# Altium schematic sheet Power.SchDoc
size A
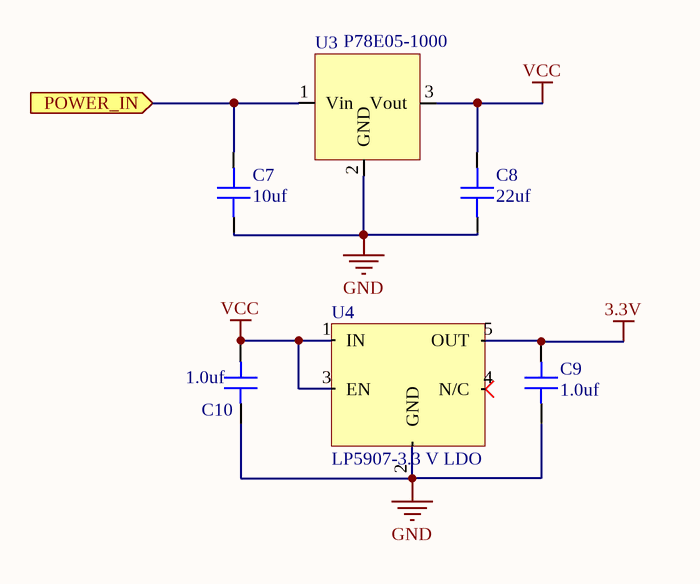
[diagram p0: Power.SchDoc]

## Parts
C7  value 10uf  [CAP 1206/3216 - 1.8MM]  (hidden comment: Capacitor MLCC 1.1pf 50V CAP 1206/3216)
C8  value 22uf  [CAP 0805/2012]  (hidden comment: Capacitor MLCC 22uf 16V CAP 0805/2012)
C9  value 1.0uf  [CAP 0603/1608]  (hidden comment: Capacitor MLCC 1.0uf 16V CAP 0603/1608)
C10  value 1.0uf  [CAP 0603/1608]  (hidden comment: Capacitor MLCC 1.0uf 16V CAP 0603/1608)
U3  P78E05-1000  [P78E05]
U4  LP5907-3.3 V LDO  [SOT23-5]

## Ports
POWER_IN (in)

## Nets
3.3V: C9.2 U4.5(OUT)
GND: C7.1 C8.1 C9.1 C10.1 U3.2(GND) U4.2(GND)
VCC: C8.2 C10.2 U3.3(Vout) U4.1(IN) U4.3(EN)
POWER_IN: C7.2 U3.1(Vin) ; port POWER_IN

Not connected (* = marked no-connect by the designer): U4 4(N/C)*

## Library data of the parts
C7 = 1081: Manufacturer_id: 1; idCapacitor: 1081; Name: Cap_10uf_50V_CAP 1206-3216; Dielectric: Ceramic; ESR: Null; Created_By: Nick Mah; Drawer_id: 1; Voltage_Rating: 50V; Package: CAP 2106/3216; ComponentLink1Description: Datasheet
C8 = 357: Manufacturer_id: 1; idCapacitor: 357; Name: Cap_22uf_16V_CAP 0805/2012; Dielectric: Ceramic; Created_By: Nick Mah; Drawer_id: 1; Voltage_Rating: 16V; Package: CAP 0805/2012; Created_Date: 10/20/2018
C9 C10 = 229: Manufacturer_id: 1; idCapacitor: 229; Name: Cap_1.0uf_16V_CAP 0603/1608; Dielectric: Ceramic; Created_By: Nick Mah; Drawer_id: 1; Voltage_Rating: 16V; Package: CAP 0603/1608; Created_Date: 10/20/2018
U3 = 1: Non-Isolated PoL Module DC DC Converter 1 Output 5V    1A 8V - 36V Input; Manufacturer_id: 11; idPMIC_SW: 1; Name: P78E05 5V Regulator; Value: Buck; Discrete: No; Power: 5W; Vout_Type: Fixed; Fs: 520kHz; Created_By: Nick; MfrPartNo: P78E05-1000; Drawer_id: 1; Num_Outputs: 1; Topology: Buck; Vin(Min): 8V; Vin(Max): 36V; Vout(Min): 5V; Vout(Max): 5V; Current_Rating: 1A; Package: 3-SIP; Link: https://www.digikey.com/product-detail/en/cui-inc/P78E05-1000/102-5018-ND/9649654; ComponentLink1Description: Datasheet; ComponentLink1URL: https://www.cui.com/product/resource/p78e-1000.pdf; Supplier1: Digi-Key; Supplier1PartNo: 102-5018-ND
U4 = 4: Manufacturer_id: 1; MfrPartNo: LP5907; idPMIC_Lin: 4; Name: LP5907 LDO; Value: 5.5V; Vin(Max): 6V; Drawer_id: 1; Package: SOT23-5